# EAGLE design ETH_EX_M32 (EAGLE 4.16)
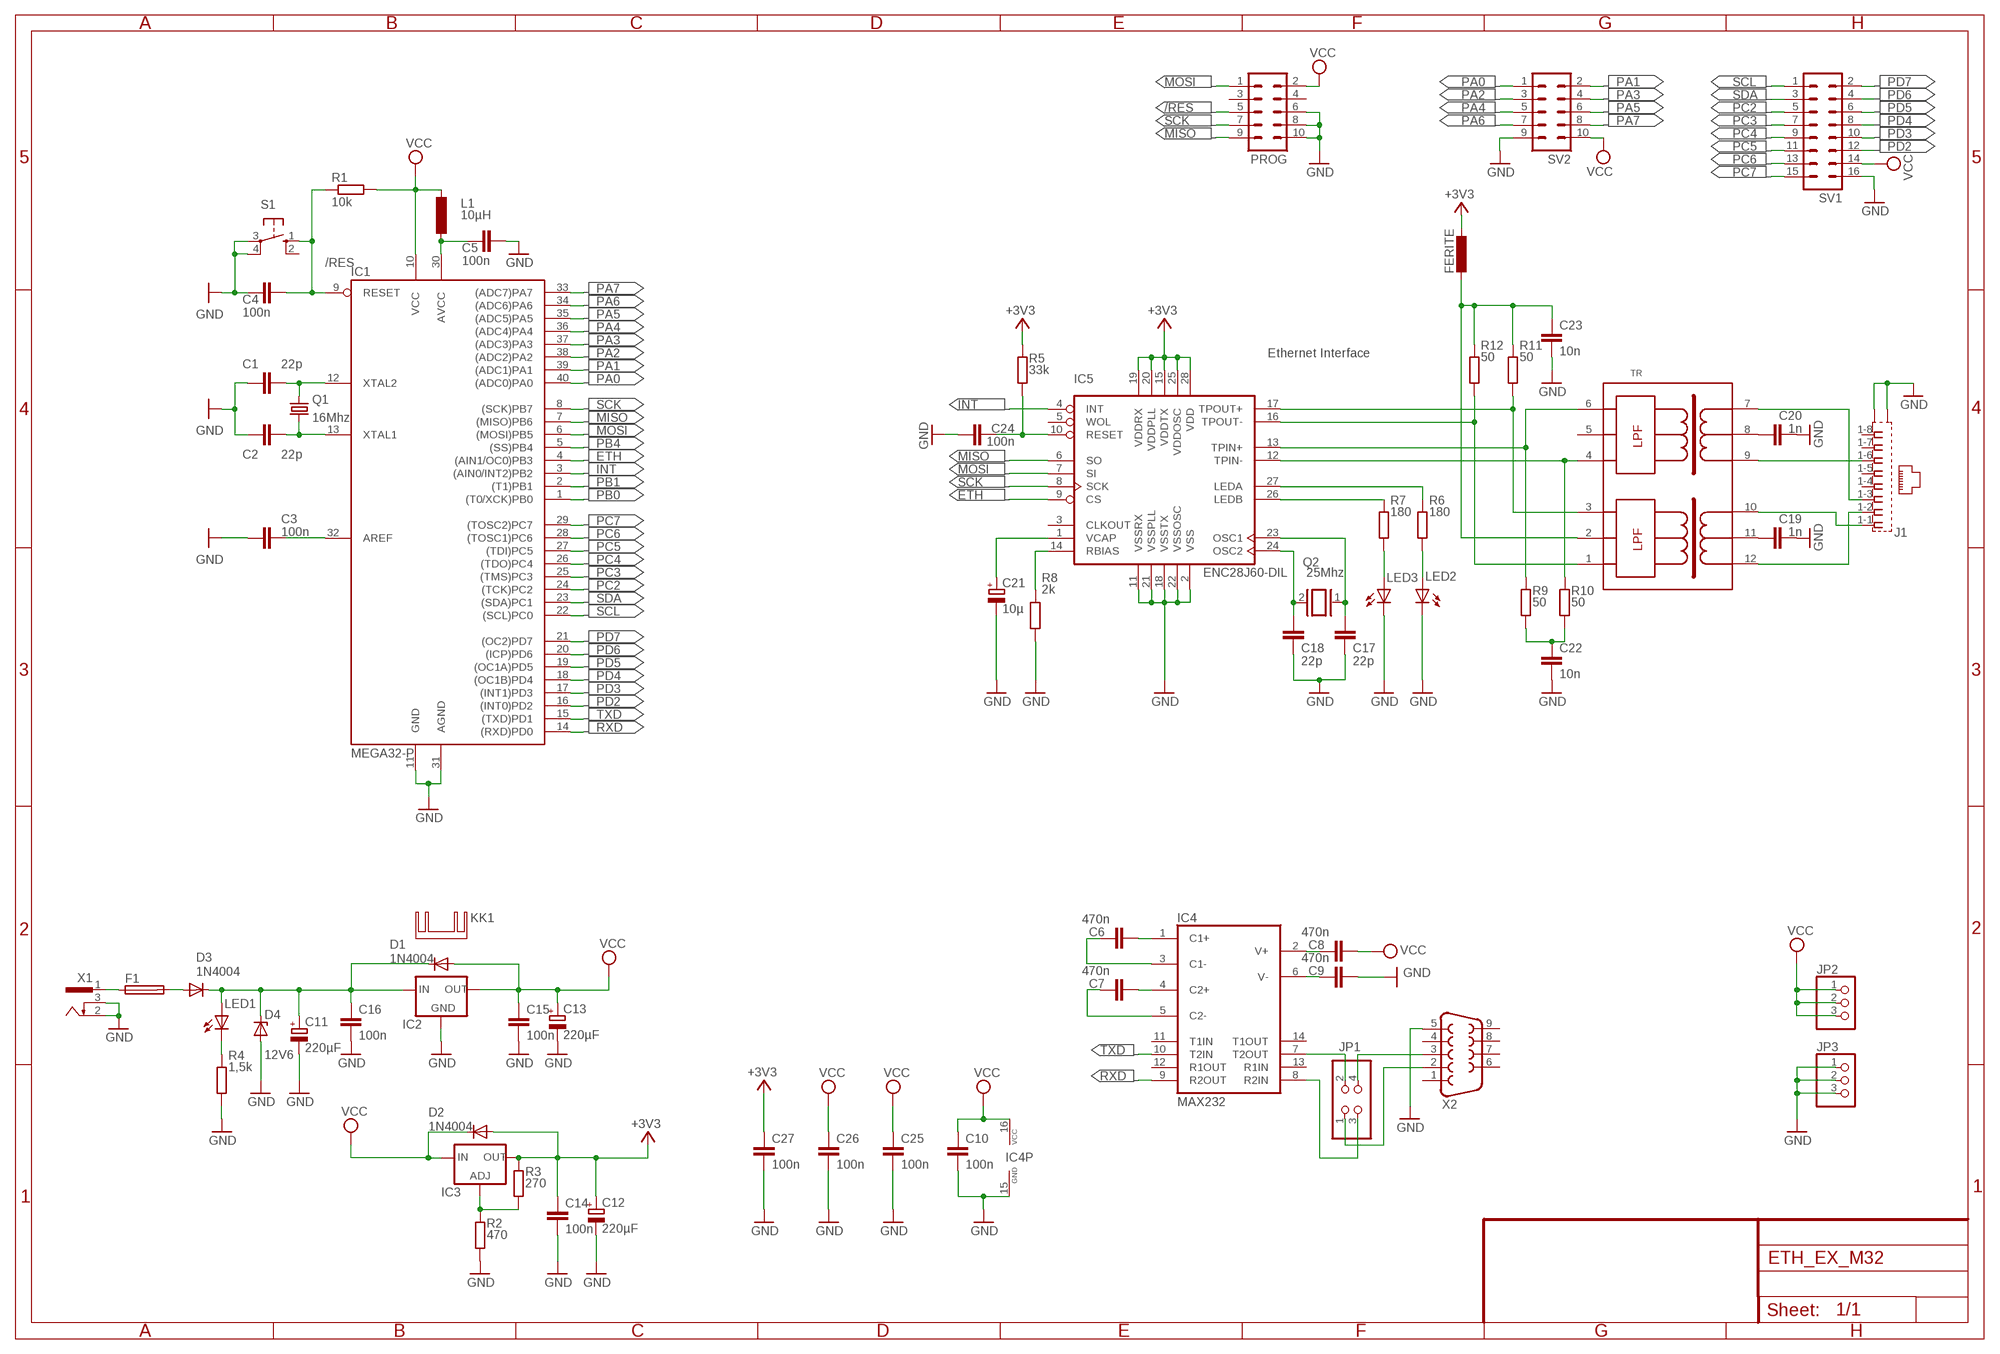
[diagram p0: schematic, sheet 1]

## Parts
C1  22p  C-EU025-024X044  [C025-024X044]
C2  22p  C-EU025-024X044  [C025-024X044]
C3  100n  C-EU025-025X050  [C025-025X050]
C4  100n  C-EU025-024X044  [C025-024X044]
C5  100n  C-EU025-024X044  [C025-024X044]
C6  470n  C-EU050-024X044  [C050-024X044]
C7  470n  C-EU050-024X044  [C050-024X044]
C8  470n  C-EU050-024X044  [C050-024X044]
C9  470n  C-EU050-024X044  [C050-024X044]
C10  100n  C-EU050-024X044  [C050-024X044]
C11  220µF  CPOL-EUE3.5-8  [E3,5-8]
C12  220µF  CPOL-EUE3.5-8  [E3,5-8]
C13  220µF  CPOL-EUE3.5-8  [E3,5-8]
C14  100n  C-EU025-024X044  [C025-024X044]
C15  100n  C-EU050-024X044  [C050-024X044]
C16  100n  C-EU050-024X044  [C050-024X044]
C17  22p  C-EU025-024X044  [C025-024X044]
C18  22p  C-EU025-024X044  [C025-024X044]
C19  1n  C-EU025-024X044  [C025-024X044]
C20  1n  C-EU025-024X044  [C025-024X044]
C21  10µ  CPOL-EUE2-5  [E2-5]
C22  10n  C-EU025-025X050  [C025-025X050]
C23  10n  C-EU025-025X050  [C025-025X050]
C24  100n  C-EU025-024X044  [C025-024X044]
C25  100n  C-EU025-025X050  [C025-025X050]
C26  100n  C-EU025-025X050  [C025-025X050]
C27  100n  C-EU025-025X050  [C025-025X050]
D1  1N4004  [DO41-10]
D2  1N4004  [DO41-10]
D3  1N4004  [DO41-10]
D4  12V6  BZX90  [DO34Z7]
F1  PICOFUSE  [PICOFUSE]
FERITE  L-EU0204/5  [0204/5]
IC1  MEGA32-P  [DIL40]
IC2  78XXS  [78XXS]
IC3  LM317TS  [317TS]
IC4  MAX232  [DIL16]
IC5  ENC28J60-DIL  [DIL28-3]
J1  557786-1  [557786-1]
JP1  PINHD-2X2  [2X02]
JP2  PINHD-1X3  [1X03]
JP3  PINHD-1X3  [1X03]
KK1  SK95-2M3  [SK95-2M3]
L1  10µH  L-EU0207/10  [0207/10]
LED1  LED3MM  [LED3MM]
LED2  LED3MM  [LED3MM]
LED3  LED3MM  [LED3MM]
PROG  ML10  [ML10]
Q1  16Mhz  CRYTALHC49U-V  [HC49U-V]
Q2  25Mhz  XTAL/S  [QS]
R1  10k  R-EU_0207/10  [0207/10]
R2  470  R-EU_0207/10  [0207/10]
R3  270  R-EU_0207/10  [0207/10]
R4  1,5k  R-EU_0207/10  [0207/10]
R5  33k  R-EU_0207/10  [0207/10]
R6  180  R-EU_0207/10  [0207/10]
R7  180  R-EU_0207/10  [0207/10]
R8  2k  R-EU_0207/10  [0207/10]
R9  50  R-EU_0207/10  [0207/10]
R10  50  R-EU_0207/10  [0207/10]
R11  50  R-EU_0207/10  [0207/10]
R12  50  R-EU_0207/10  [0207/10]
S1  10-XX  [B3F-10XX]
SV1  ML16  [ML16]
SV2  ML10  [ML10]
TR  20F001  [DIL16/12]
X1  SCD-014A  [SCD-014-A]
X2  F09HP  [F09HP]

## Nets
+3V3: C12.+ C14.1 C27.1 D2.A FERITE.1 IC3.2(OUT) IC5.15(VDDTX) IC5.19(VDDRX) IC5.20(VDDPLL) IC5.25(VDDOSC) IC5.28(VDD) R3.2 R5.2
/RES: C4.2 IC1.9(RESET) PROG.5 R1.1 S1.1(S)
ETH: IC1.4((AIN1/OC0)PB3) IC5.9(CS)
GND: C1.1 C2.1 C3.1 C4.1 C5.2 C9.2 C10.2 C11.- C12.- C13.- C14.2 C15.2 C16.2 C17.1 C18.1 C19.2 C20.2 C21.- C22.2 C23.2 C24.1 C25.1 C26.2 C27.2 D4.A IC1.11(GND) IC1.31(AGND) IC2.GND IC4.15(GND) IC5.2(VSS) IC5.11(VSSRX) IC5.18(VSSTX) IC5.21(VSSPLL) IC5.22(VSSOSC) J1.G1(S2) J1.G2(S1) JP3.1 JP3.2 JP3.3 LED2.K(C) LED3.K(C) PROG.6 PROG.8 PROG.10 R2.1 R4.1 R8.1 S1.3(P) S1.4(P1) SV1.16 SV2.9 X1.2 X1.3 X2.5
INT: IC1.3((AIN0/INT2)PB2) IC5.4(INT)
MISO: IC1.7((MISO)PB6) IC5.6(SO) PROG.9
MOSI: IC1.6((MOSI)PB5) IC5.7(SI) PROG.1
N$1: C2.2 IC1.13(XTAL1) Q1.1
N$2: C1.2 IC1.12(XTAL2) Q1.2
N$3: C3.2 IC1.32(AREF)
N$4: LED1.K(C) R4.2
N$5: C5.1 IC1.30(AVCC) L1.2
N$6: D3.A F1.2
N$7: J1.1-2 TR.12
N$8: J1.1-1 TR.10
N$10: F1.1 X1.1
N$11: IC5.27(LEDA) R6.2
N$12: IC3.1(ADJ) R2.2 R3.1
N$13: J1.1-6 TR.9
N$14: IC5.26(LEDB) R7.2
N$15: J1.1-3 TR.7
N$16: C20.1 TR.8
N$17: C19.1 TR.11
N$18: LED3.A R7.1
N$19: LED2.A R6.1
N$20: C18.2 IC5.24(OSC2) Q2.2
N$21: C17.2 IC5.23(OSC1) Q2.1
N$22: IC5.12(TPIN-) R10.2 TR.4
N$23: IC5.13(TPIN+) R9.2 TR.6
N$24: IC5.16(TPOUT-) R12.2 TR.1
N$25: IC5.17(TPOUT+) R11.2 TR.3
N$26: IC5.14(RBIAS) R8.2
N$27: C21.+ IC5.1(VCAP)
N$29: C22.1 R9.1 R10.1
N$30: C24.2 IC5.10(RESET) R5.1
N$40: JP1.1 X2.2
N$49: JP1.4 X2.3
N$50: IC4.8(R2IN) JP1.3
N$51: IC4.7(T2OUT) JP1.2
N$52: C7.2 IC4.4(C2+)
N$53: C7.1 IC4.5(C2-)
N$56: C6.1 IC4.3(C1-)
N$57: C6.2 IC4.1(C1+)
N$58: C8.1 IC4.2(V+)
N$59: C9.1 IC4.6(V-)
N$248: C23.1 FERITE.2 R11.1 R12.1 TR.2
N$250: C11.+ C16.1 D1.C D3.C D4.C IC2.IN LED1.A
PA0: IC1.40((ADC0)PA0) SV2.1
PA1: IC1.39((ADC1)PA1) SV2.2
PA2: IC1.38((ADC2)PA2) SV2.3
PA3: IC1.37((ADC3)PA3) SV2.4
PA4: IC1.36((ADC4)PA4) SV2.5
PA5: IC1.35((ADC5)PA5) SV2.6
PA6: IC1.34((ADC6)PA6) SV2.7
PA7: IC1.33((ADC7)PA7) SV2.8
PB0: IC1.1((T0/XCK)PB0)
PB1: IC1.2((T1)PB1)
PB4: IC1.5((SS)PB4)
PC2: IC1.24((TCK)PC2) SV1.5
PC3: IC1.25((TMS)PC3) SV1.7
PC4: IC1.26((TDO)PC4) SV1.9
PC5: IC1.27((TDI)PC5) SV1.11
PC6: IC1.28((TOSC1)PC6) SV1.13
PC7: IC1.29((TOSC2)PC7) SV1.15
PD2: IC1.16((INT0)PD2) SV1.12
PD3: IC1.17((INT1)PD3) SV1.10
PD4: IC1.18((OC1B)PD4) SV1.8
PD5: IC1.19((OC1A)PD5) SV1.6
PD6: IC1.20((ICP)PD6) SV1.4
PD7: IC1.21((OC2)PD7) SV1.2
RXD: IC1.14((RXD)PD0) IC4.9(R2OUT)
SCK: IC1.8((SCK)PB7) IC5.8(SCK) PROG.7
SCL: IC1.22((SCL)PC0) SV1.1
SDA: IC1.23((SDA)PC1) SV1.3
TXD: IC1.15((TXD)PD1) IC4.10(T2IN)
VCC: C8.2 C10.1 C13.+ C15.1 C25.2 C26.1 D1.A D2.C IC1.10(VCC) IC2.OUT IC3.3(IN) IC4.16(VCC) JP2.1 JP2.2 JP2.3 L1.1 PROG.2 R1.2 SV1.14 SV2.10
Unconnected: IC4.11(T1IN) IC4.12(R1OUT) IC4.13(R1IN) IC4.14(T1OUT) IC5.3(CLKOUT) IC5.5(WOL) J1.1-4 J1.1-5 J1.1-7 J1.1-8 PROG.3 PROG.4 S1.2(S1) TR.5 X2.1 X2.4 X2.6 X2.7 X2.8 X2.9

## Notes on the sheet
- Ethernet Interface

## Library data of the parts
C1-C10 C14-C20 C22-C27 = rcl:C-EU: CAPACITOR, European symbol
C11-C13 C21 = rcl:CPOL-EU: POLARIZED CAPACITOR, European symbol
D1-D3 = diode:1N4004: DIODE general purpose rectifier, 1 A
D4 = diode:BZX90: Z DIODE
F1 = fuse:PICOFUSE: PICOFUSE 19275, Wickmann
FERITE L1 = rcl:L-EU: INDUCTOR, European symbol
IC1 = avr-1:MEGA32-P: MICROCONTROLLER 32 Kbytes FLASH 2 Kbytes SRAM 1 Kbytes EEPROM USART 8-channel 10 bit ADC
IC2 = v-reg:78XXS: VOLTAGE REGULATOR
IC3 = v-reg:LM317TS: VOLTAGE REGULATOR
IC4 = maxim:MAX232: RS232 TRANSEIVER
IC5 = enc28j60centered:ENC28J60-*: Microchip 10Mbit Ethernet controller with SPI interface Improved SOIC28 layout (pads in 0.01 raster, pin1 slightly smaller). Pin 6 (SO) changed from Out (paralleling several Outs gives an error) to OC. Author: Profi from mikrocontroller.net - forum Date: 2006.0827
J1 = con-amp:557786-1: AMP connector
JP1 = pinhead:PINHD-2X2: PIN HEADER
JP2 JP3 = pinhead:PINHD-1X3: PIN HEADER
KK1 = heatsink:SK95-2M3: HEATSINK manufacturer Fischer/distributor Buerklin
LED1-LED3 = led:LED: LED OSRAM: - CHIPLED LG R971, LG N971, LY N971, LG Q971, LY Q971, LO R971, LY R971 LH N974, LH R974 LS Q976, LO Q976, LY Q976 LO Q996 - Hyper CHIPLED LW Q18S LB Q993, LB Q99A, LB R99A - SideLED LS A670, LO A670, LY A670, LG A670, LP A670 LB A673, LV A673, LT A673, LW A673 LH A674 LY A675 LS A676, LA A676, LO A676, LY A676, LW A676 LS A679, LY A679, LG A679 - Hyper Micro SIDELED® LS Y876, LA Y876, LO Y876, LY Y876 LT Y87S - SmartLED LW L88C, LW L88S LB L89C, LB L89S, LG L890 LS L89K, LO L89K, LY L89K LS L896, LA L896, LO L896, LY L896 - TOPLED LS T670, LO T670, LY T670, LG T670, LP T670 LSG T670, LSP T670, LSY T670, LOP T670, LYG T670 LG T671, LOG T671, LSG T671 LB T673, LV T673, LT T673, LW T673 LH T674 LS T676, LA T676, LO T676, LY T676, LB T676, LH T676, LSB T676, LW T676 LB T67C, LV T67C, LT T67C, LS T67K, LO T67K, LY T67K, LW E67C LS E67B, LA E67B, LO E67B, LY E67B, LB E67C, LV E67C, LT E67C LW T67C LS T679, LY T679, LG T679 LS T770, LO T770, LY T770, LG T770, LP T770 LB T773, LV T773, LT T773, LW T773 LH T774 LS E675, LA E675, LY E675, LS T675 LS T776, LA T776, LO T776, LY T776, LB T776 LHGB T686 LT T68C, LB T68C - Hyper Mini TOPLED® LB M676 - Mini TOPLED Santana® LG M470 LS M47K, LO M47K, LY M47K Source: http://www.osram.convergy.de/
PROG SV2 = con-harting-ml:ML10: HARTING
Q1 = crystal:CRYTAL: CRYSTAL
Q2 = special:XTAL/S: CRYSTAL
R1-R12 = rcl:R-EU_: RESISTOR, European symbol
S1 = switch-omron:10-XX: OMRON SWITCH
SV1 = con-harting-ml:ML16: HARTING
TR = Realtek:20F001
X1 = con-shiua-chyuan:SCD-014A: Power Jack 2.5mm
X2 = con-subd:F09: SUB-D

## Board
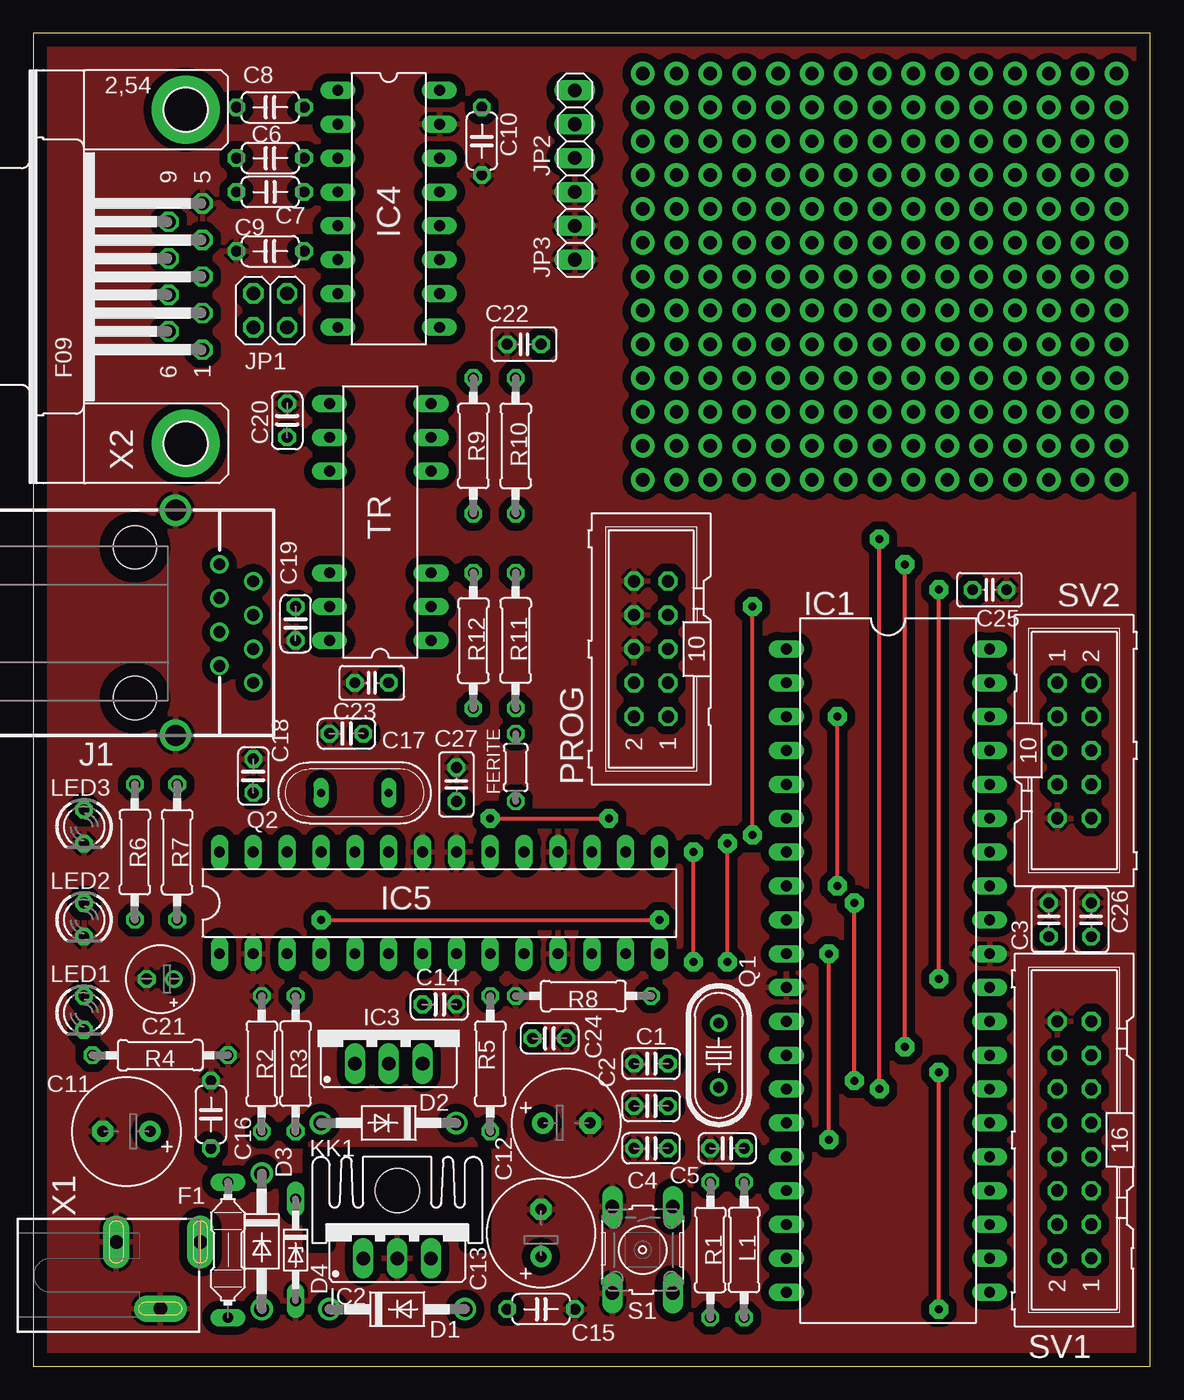
[diagram p1: board, top side]
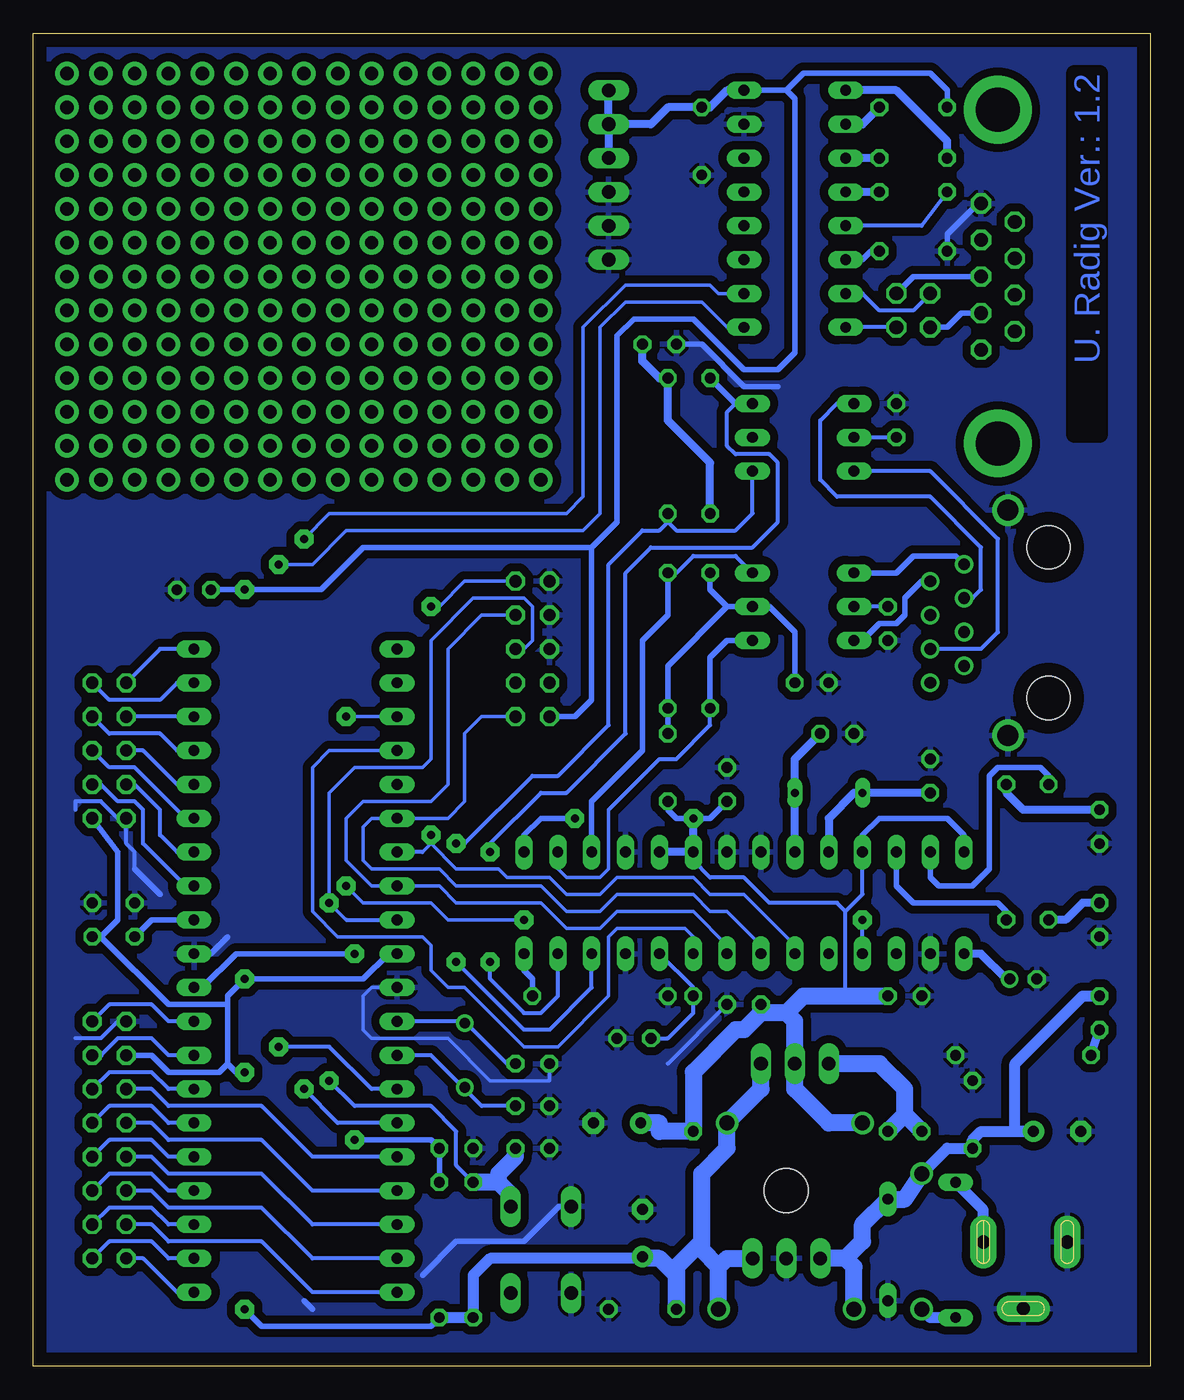
[diagram p2: board, bottom side, seen from below]

Size 83.8 x 100 mm. Coordinates in mm from the lower left corner, seen from the top.
Outline: 0,0 83.8,0 83.8,100 0,100 0,0
Copper layers (1*16): Top 0.035mm / dielectric 1.5mm / Bottom 0.035mm
Design rules "default": minimum track width 10mil, minimum drill 24mil, track to track 8mil, track to pad 8mil, pad to pad 8mil, via to via 8mil, smd to smd 8mil, copper to edge 40mil, drill to drill 8mil, minimum pad ring 10mil, minimum via ring 8mil, stop-mask expansion 4mil, vias tented up to drill 0mil, thermal gap 10mil

### Footprints (pad centres in the part's own frame; a part is rotated, then mirrored left to right if it is on the bottom)
C025-024X044 = drill 0.813 octagon: 1 -1.27,0; 2 1.27,0
C025-025X050 = drill 0.813 octagon: 1 -1.27,0; 2 1.27,0
C050-024X044 = drill 0.813 octagon: 1 -2.54,0; 2 2.54,0
E3,5-8 = drill 0.813 pad 1.6 round: + -1.778,0 | drill 0.813 pad 1.6 octagon: - 1.778,0
E2-5 = drill 0.813 pad 1.27 round: + -1.016,0 | drill 0.813 pad 1.27 octagon: - 1.016,0
DO41-10 = drill 1.118 round: A 5.08,0; C -5.08,0
DO34Z7 = drill 0.813 long: A 3.81,0; C -3.81,0
PICOFUSE = drill 0.813 long: 1 -5.08,0; 2 5.08,0
0204/5 = drill 0.813 octagon: 1 -2.54,0; 2 2.54,0
DIL40 = drill 0.813 long: 1 -24.13,-7.62; 2 -21.59,-7.62; 3 -19.05,-7.62; 4 -16.51,-7.62; 5 -13.97,-7.62; 6 -11.43,-7.62; 7 -8.89,-7.62; 8 -6.35,-7.62; 9 -3.81,-7.62; 10 -1.27,-7.62; 11 1.27,-7.62; 12 3.81,-7.62; 13 6.35,-7.62; 14 8.89,-7.62; 15 11.43,-7.62; 16 13.97,-7.62; 17 16.51,-7.62; 18 19.05,-7.62; 19 21.59,-7.62; 20 24.13,-7.62; 21 24.13,7.62; 22 21.59,7.62; 23 19.05,7.62; 24 16.51,7.62; 25 13.97,7.62; 26 11.43,7.62; 27 8.89,7.62; 28 6.35,7.62; 29 3.81,7.62; 30 1.27,7.62; 31 -1.27,7.62; 32 -3.81,7.62; 33 -6.35,7.62; 34 -8.89,7.62; 35 -11.43,7.62; 36 -13.97,7.62; 37 -16.51,7.62; 38 -19.05,7.62; 39 -21.59,7.62; 40 -24.13,7.62
78XXS = drill 1.016 long: GND 0,-2.54; IN -2.54,-2.54; OUT 2.54,-2.54
317TS = drill 1.016 long: 1 -2.54,-2.54; 2 0,-2.54; 3 2.54,-2.54
DIL16 = drill 0.813 long: 1 -8.89,-3.81; 2 -6.35,-3.81; 3 -3.81,-3.81; 4 -1.27,-3.81; 5 1.27,-3.81; 6 3.81,-3.81; 7 6.35,-3.81; 8 8.89,-3.81; 9 8.89,3.81; 10 6.35,3.81; 11 3.81,3.81; 12 1.27,3.81; 13 -1.27,3.81; 14 -3.81,3.81; 15 -6.35,3.81; 16 -8.89,3.81
DIL28-3 = drill 0.813 long: 1 -16.51,-3.81; 2 -13.97,-3.81; 3 -11.43,-3.81; 4 -8.89,-3.81; 5 -6.35,-3.81; 6 -3.81,-3.81; 7 -1.27,-3.81; 8 1.27,-3.81; 9 3.81,-3.81; 10 6.35,-3.81; 11 8.89,-3.81; 12 11.43,-3.81; 13 13.97,-3.81; 14 16.51,-3.81; 15 16.51,3.81; 16 13.97,3.81; 17 11.43,3.81; 18 8.89,3.81; 19 6.35,3.81; 20 3.81,3.81; 21 1.27,3.81; 22 -1.27,3.81; 23 -3.81,3.81; 24 -6.35,3.81; 25 -8.89,3.81; 26 -11.43,3.81; 27 -13.97,3.81; 28 -16.51,3.81
557786-1 = drill 0.889 round: 1-1 -4.445,6.35; 1-2 -3.175,8.89; 1-3 -1.905,6.35; 1-4 -0.635,8.89; 1-5 0.635,6.35; 1-6 1.905,8.89; 1-7 3.175,6.35; 1-8 4.445,8.89 | drill 1.575 pad 2.184 round: G1 -8.509,3.048; G2 8.382,3.048 | hole 3.251: -5.715,0; 5.588,0
2X02 = drill 1.016 octagon: 1 -1.27,-1.27; 2 -1.27,1.27; 3 1.27,-1.27; 4 1.27,1.27
1X03 = drill 1.016 long: 1 -2.54,0; 2 0,0; 3 2.54,0
SK95-2M3 = hole 3.302: 0,2.54
0207/10 = drill 0.813 octagon: 1 -5.08,0; 2 5.08,0
LED3MM = drill 0.813 octagon: A -1.27,0; K 1.27,0
ML10 = drill 0.914 octagon: 1 -5.08,-1.27; 2 -5.08,1.27; 3 -2.54,-1.27; 4 -2.54,1.27; 5 0,-1.27; 6 0,1.27; 7 2.54,-1.27; 8 2.54,1.27; 9 5.08,-1.27; 10 5.08,1.27
HC49U-V = drill 0.813 round: 1 -2.413,0; 2 2.413,0
QS = drill 0.61 long: 1 -2.54,0; 2 2.54,0
B3F-10XX = drill 1.016 long: 1 -3.251,2.261; 2 3.251,2.261; 3 -3.251,-2.261; 4 3.251,-2.261
ML16 = drill 0.914 octagon: 1 -8.89,-1.27; 2 -8.89,1.27; 3 -6.35,-1.27; 4 -6.35,1.27; 5 -3.81,-1.27; 6 -3.81,1.27; 7 -1.27,-1.27; 8 -1.27,1.27; 9 1.27,-1.27; 10 1.27,1.27; 11 3.81,-1.27; 12 3.81,1.27; 13 6.35,-1.27; 14 6.35,1.27; 15 8.89,-1.27; 16 8.89,1.27
DIL16/12 = drill 0.813 long: 1 -8.89,-3.81; 2 -6.35,-3.81; 3 -3.81,-3.81; 4 3.81,-3.81; 5 6.35,-3.81; 6 8.89,-3.81; 7 8.89,3.81; 8 6.35,3.81; 9 3.81,3.81; 10 -3.81,3.81; 11 -6.35,3.81; 12 -8.89,3.81
SCD-014-A = drill 1 pad 2 long: 1 -2.5,13.8; 2 -2.5,7.5; 3 2.5,10.8
F09HP = drill 1.016 octagon: 1 -5.486,-1.27; 2 -2.743,-1.27; 3 0,-1.27; 4 2.743,-1.27; 5 5.486,-1.27; 6 -4.115,1.27; 7 -1.372,1.27; 8 1.372,1.27; 9 4.115,1.27 | drill 3.302 pad 5.08 round: G1 -12.522,0; G2 12.522,0

### Placement (x,y rotation side)
C1  46.35,22.7 0 top
C2  46.35,19.52 0 top
C3  76.2,33.49 270 top
C4  46.35,16.35 0 top
C5  52.06,16.35 180 top
C6  17.78,90.64 180 top
C7  17.78,88.1 0 top
C8  17.78,94.45 180 top
C9  17.78,83.65 180 top
C10  33.65,91.91 270 top
C11  6.98,17.62 180 top
C12  40,18.25 0 top
C13  38.09,10 90 top
C14  30.48,27.14 0 top
C15  38.09,4.28 0 top
C16  13.33,18.89 90 top
C17  23.49,47.46 0 top
C18  16.51,44.29 270 top
C19  19.68,55.72 270 top
C20  19.05,70.95 90 top
C21  9.52,29.05 180 top
C22  36.82,76.67 180 top
C23  25.39,51.27 180 top
C24  38.73,24.6 180 top
C25  71.75,58.26 180 top
C26  79.37,33.49 90 top
C27  31.75,43.65 90 top
D1  27.3,4.28 0 top
D2  26.67,18.25 180 top
D3  17.14,9.36 270 top
D4  19.68,8.73 270 top
F1  14.6,8.73 270 top
FERITE  36.19,44.92 90 top
IC1  64.13,29.68 270 top
IC2  27.3,10.63 0 top
IC3  26.67,25.23 0 top
IC4  26.67,86.83 270 top
IC5  30.48,34.76 0 top
J1  7.62,55.72 270 top
JP1  17.78,79.21 0 top
JP2  40.63,93.18 90 top
JP3  40.63,85.56 90 top
KK1  27.3,10.63 0 top
L1  53.34,8.73 90 top
LED1  3.81,26.51 270 top
LED2  3.81,33.49 270 top
LED3  3.81,40.48 270 top
PROG  46.35,53.81 90 top
Q1  51.43,23.33 90 top
Q2  24.12,43.02 180 top
R1  50.79,8.73 270 top
R2  17.14,22.7 270 top
R3  19.68,22.7 90 top
R4  9.52,23.33 180 top
R5  34.28,22.7 270 top
R6  7.62,38.57 90 top
R7  10.79,38.57 270 top
R8  41.27,27.78 0 top
R9  33.02,69.05 90 top
R10  36.19,69.05 270 top
R11  36.19,54.45 90 top
R12  33.02,54.45 270 top
S1  45.71,8.73 270 top
SV1  78.1,16.98 90 top
SV2  78.1,46.19 270 top
TR  26.03,63.34 90 top
X1  -1.27,6.82 270 top
X2  11.42,81.75 90 top

### Tracks (layer width: path | path; a pad name or v marks a point on that pad's centre or on a via)
+3V3  (via drill 0.6 pad 1.42)
  Top 0.305: v34.28,41.11 v43.17,41.11
  Bottom 0.305: IC5.25 21.59,35.4 22.86,34.12 | IC5.20 34.28,37.94 33.02,36.66 30.48,36.66 28.57,34.76 23.49,34.76 22.86,34.12 | 22.86,27.78 22.86,34.12
  Bottom 0.406: IC5.28 13.96,39.84 15.23,41.11 20.32,41.11 21.59,39.84 IC5.25 | v43.17,41.11 45.71,41.11 46.98,39.84 IC5.15 | C27.1 33.02,41.11 v34.28,41.11 | v34.28,41.11 34.92,41.11 | v34.28,41.11 35.55,41.11 36.19,41.74 FERITE.1 | IC5.20 IC5.19 IC5.20
  Bottom 0.61: IC5.19 IC5.20 v34.28,41.11
  Bottom 1.27: C12.+ 36.82,18.25 36.82,17.62 R5.2 34.28,22.06 31.11,25.23 30.48,25.23 29.21,26.51 | D2.A 24.12,18.25 26.67,20.79 IC3.2 26.67,25.87 27.3,26.51 | 29.21,26.51 C14.1 | 27.3,26.51 29.21,26.51 | R3.2 22.86,27.78 26.03,27.78 27.3,26.51
/RES  (via drill 0.6 pad 1.42)
  Top 0.305: v61.59,21.43 v61.59,34.76
  Bottom 0.254: 60.32,33.49 v61.59,34.76 61.59,43.02 59.68,44.92 54.6,44.92 53.97,45.55 53.97,54.45 50.79,57.62 46.98,57.62 46.35,56.98 46.35,54.45 46.98,53.81 PROG.5
  Bottom 0.305: 48.89,14.44 R1.1 52.06,15.08 52.06,17.62 53.97,19.52 59.68,19.52 v61.59,21.43 | 60.32,33.49 IC1.9
  Bottom 1.27: S1.1 47.98,12.89 48.89,13.81 | 48.89,13.81 R1.1 | 48.89,13.81 48.89,14.44 47.62,15.71 C4.2
ETH
  Bottom 0.254: IC5.9 34.28,32.22 34.92,32.86 40,32.86 40.63,32.22 40.63,27.78 44.45,23.96 46.98,23.96 51.43,28.41 52.7,28.41 53.97,29.68 53.97,31.59 54.6,32.22 60.95,32.22 62.86,34.12 62.86,44.92 61.59,46.19 IC1.4
GND
  Bottom 0.254: C1.1 45.08,21.43 49.52,21.43 52.7,24.6 58.41,24.6 59.05,25.23 59.05,27.78 58.41,28.41 IC1.11
  Bottom 0.305: SV1.16 77.47,25.87 78.73,24.6 80.64,24.6 | 76.2,37.3 76.2,38.57 76.83,39.2 SV2.9 77.47,41.11 78.73,42.38 80.64,42.38 80.64,41.74 | C14.2 36.19,22.7
  Bottom 0.406: 74.29,35.4 76.2,37.3 | C22.2 33.65,76.67 30.48,73.49 27.94,73.49 | X2.5 12.92,87.24 15.23,84.92 C9.2 | IC1.31 70.48,30.95 69.21,32.22 | S1.3 44.37,11.98 46.98,9.36 52.06,9.36 54.6,6.82 | 62.86,4.28 63.49,4.92
  pour Bottom (isolate 0.61): 0.63,99.53 0.63,0.47 83.18,0.47 83.18,99.53
  pour Top (isolate 0.61): 0.63,99.53 83.18,99.53 83.18,0.47 0.63,0.47
INT  (via drill 0.6 pad 1.42)
  Top 0.305: v21.59,33.49 v46.98,33.49 | v60.32,36.03 v60.32,48.73
  Bottom 0.254: v46.98,33.49 52.7,33.49 53.97,34.76 59.05,34.76 v60.32,36.03 | v60.32,48.73 IC1.3
  Bottom 0.305: IC5.4 v21.59,33.49
MISO  (via drill 0.6 pad 1.42)
  Top 0.305: v53.97,39.84 v53.97,56.98
  Bottom 0.254: IC5.6 26.67,31.59 30.48,35.4 33.02,35.4 34.28,36.66 40,36.66 41.27,35.4 43.81,35.4 45.08,36.66 48.25,36.66 48.89,37.3 52.06,37.3 53.97,39.2 | v53.97,56.98 53.34,56.98 51.43,58.89 PROG.9 | 53.97,39.2 v53.97,39.84 | 53.97,39.2 54.6,38.57
  Bottom 0.305: 54.6,38.57 IC1.7
MOSI
  Bottom 0.254: IC5.7 29.21,31.59 31.75,34.12 33.02,34.12 34.28,35.4 40,35.4 41.27,34.12 43.81,34.12 45.71,36.03 52.06,36.03 53.34,37.3 58.41,37.3 59.05,37.94 59.05,40.48 58.41,41.11 IC1.6 52.7,41.11 51.43,42.38 51.43,47.46 50.16,48.73 PROG.1
N$1
  Bottom 0.305: C2.2 50.16,19.52 51.43,20.79 | 51.43,20.79 Q1.1 | 51.43,20.79 53.97,23.33 IC1.13
N$2
  Bottom 0.305: C1.2 48.25,22.7 51.43,25.87 | 51.43,25.87 Q1.2 | 51.43,25.87 IC1.12
N$3
  Bottom 0.406: C3.2 74.93,33.49 IC1.32
N$4
  Bottom 0.61: R4.2 LED1.K
N$5  (via drill 0.6 pad 1.42)
  Top 0.305: v59.68,16.98 v59.68,30.95
  Bottom 0.305: 71.12,28.41 IC1.30
  Bottom 0.406: L1.2 C5.1 53.97,16.98 v59.68,16.98 | v59.68,30.95 68.58,30.95 71.12,28.41
N$6
  Bottom 0.813: F1.2 16.51,3.65 D3.A
N$7
  Bottom 0.406: J1.1-2 17.14,58.89 18.41,57.62 18.41,56.35 19.05,55.72 20.32,55.72 21.59,54.45 TR.12
N$8
  Bottom 0.406: J1.1-1 14.6,60.8 17.78,60.8 19.05,59.52 TR.10
N$9  (via drill 1 pad 1.78)
  other vias: 45.71,79.21
N$10
  Bottom 0.813: X1.1 12.52,11.73 F1.1
N$11
  Bottom 0.406: IC5.27 16.51,36.66 15.87,36.03 13.33,36.03 12.06,37.3 12.06,44.29 11.42,44.92 8.25,44.92 7.62,44.29 R6.2
N$12
  Bottom 1.27: R2.2 18.41,18.89 | 18.41,18.89 R3.1 | 18.41,18.89 18.41,20.79 20.32,22.7 IC3.1
N$13
  Bottom 0.305: TR.9 16.51,67.14 11.42,62.06 11.42,55.08 12.69,53.81 J1.1-6
N$14
  Bottom 0.406: IC5.26 19.05,36.03 17.78,34.76 11.42,34.76 10.79,34.12 R7.2
N$15
  Bottom 0.305: TR.7 23.49,72.22 24.76,70.95 24.76,66.51 23.49,65.24 16.51,65.24 12.69,61.43 12.69,58.26 13.33,57.62 J1.1-3
N$16
  Bottom 0.305: C20.1 TR.8
N$17
  Bottom 0.305: C19.1 TR.11
N$18
  Bottom 0.406: 10.79,43.02 R7.1
  Bottom 0.61: LED3.A 9.52,41.74 10.79,43.02
N$19
  Bottom 0.61: LED2.A 5.08,34.76 6.34,33.49 R6.1
N$20
  Bottom 0.61: IC5.24 24.12,41.11 22.22,43.02 Q2.2 C18.2
N$21
  Bottom 0.61: IC5.23 Q2.1 26.67,45.55 C17.2
N$22  (via drill 0.6 pad 1.42)
  Top 0.305: v52.06,30.32 v52.06,39.2
  Bottom 0.305: TR.4 29.84,63.97 31.11,62.7 35.55,62.7 36.19,63.34 | 36.19,63.34 R10.2 | 36.19,63.34 36.82,62.7 38.09,62.7 40.63,60.16 40.63,48.09 44.45,44.29 46.35,44.29 51.43,39.2 v52.06,39.2 | IC5.12 41.9,28.41 45.08,25.23 46.98,25.23 v52.06,30.32
N$23  (via drill 0.6 pad 1.42)
  Top 0.305: v49.52,30.32 v49.52,38.57
  Bottom 0.305: 31.11,72.22 31.75,71.59 31.75,69.05 31.11,68.41 28.57,68.41 27.94,67.78 27.94,63.34 29.84,61.43 37.46,61.43 39.36,59.52 39.36,47.46 43.81,43.02 45.71,43.02 49.52,39.2 v49.52,38.57 | IC5.13 44.45,27.78 45.71,26.51 46.98,26.51 49.52,29.05 v49.52,30.32
  Bottom 0.406: TR.6 31.11,72.22 R9.2
N$24
  Bottom 0.254: IC5.16 44.45,37.3 43.81,36.66 41.27,36.66 40.63,37.3 40.63,41.74
  Bottom 0.305: 40.63,41.74 36.82,45.55 35.55,45.55 33.02,48.09 R12.2
  Bottom 0.406: TR.1 31.75,54.45 33.02,53.18 R12.2
N$25
  Bottom 0.305: TR.3 31.11,60.8 34.28,60.8 35.55,59.52 R11.2
  Bottom 0.406: IC5.17 41.9,42.38 38.09,46.19 38.09,54.45 36.19,56.35 R11.2
N$26
  Bottom 0.406: IC5.14 46.98,29.68 46.35,29.05 R8.2
N$27
  Bottom 0.61: C21.+ 10.79,29.05 12.69,30.95 IC5.1
N$28  (via drill 1 pad 1.78)
  other vias: 45.71,81.75
N$29
  Bottom 0.61: R9.1 33.02,67.78 36.19,70.95 R10.1 36.82,74.13 38.09,75.4 C22.1
N$30
  Bottom 0.305: IC5.10 34.28,28.41 R5.1 34.28,26.51 36.19,24.6 C24.2
N$31  (via drill 1 pad 1.78)
  other vias: 81.28,96.99
N$32  (via drill 1 pad 1.78)
  other vias: 78.73,96.99
N$33  (via drill 1 pad 1.78)
  other vias: 76.2,96.99
N$34  (via drill 1 pad 1.78)
  other vias: 73.66,96.99
N$35  (via drill 1 pad 1.78)
  other vias: 71.12,96.99
N$36  (via drill 1 pad 1.78)
  other vias: 68.58,96.99
N$37  (via drill 1 pad 1.78)
  other vias: 66.04,96.99
N$38  (via drill 1 pad 1.78)
  other vias: 63.49,96.99
N$39  (via drill 1 pad 1.78)
  other vias: 60.95,96.99
N$40
  Bottom 0.406: X2.2 14.17,79.01 15.23,77.94 JP1.1
N$41  (via drill 1 pad 1.78)
  other vias: 58.41,96.99
N$42  (via drill 1 pad 1.78)
  other vias: 55.88,96.99
N$43  (via drill 1 pad 1.78)
  other vias: 53.34,96.99
N$44  (via drill 1 pad 1.78)
  other vias: 53.34,94.45
N$45  (via drill 1 pad 1.78)
  other vias: 55.88,94.45
N$46  (via drill 1 pad 1.78)
  other vias: 58.41,94.45
N$47  (via drill 1 pad 1.78)
  other vias: 60.95,94.45
N$48  (via drill 1 pad 1.78)
  other vias: 63.49,94.45
N$49
  Bottom 0.406: X2.3 17.78,81.75 JP1.4
N$50
  Bottom 0.305: JP1.3 IC4.8
N$51
  Bottom 0.305: JP1.2 17.78,79.21 20.32,79.21 21.59,80.48 IC4.7
N$52
  Bottom 0.61: C7.2 IC4.4
N$53
  Bottom 0.305: C7.1 17.14,85.56 IC4.5
N$54  (via drill 1 pad 1.78)
  other vias: 66.04,94.45
N$55  (via drill 1 pad 1.78)
  other vias: 68.58,94.45
N$56
  Bottom 0.61: C6.1 IC4.3
N$57
  Bottom 0.61: C6.2 15.23,91.91 19.05,95.72 IC4.1
N$58
  Bottom 0.61: C8.1 21.59,93.18 IC4.2
N$59
  Bottom 0.406: C9.1 20.95,83.65 21.59,83.02 IC4.6
N$60  (via drill 1 pad 1.78)
  other vias: 71.12,94.45
N$61  (via drill 1 pad 1.78)
  other vias: 73.66,94.45
N$62  (via drill 1 pad 1.78)
  other vias: 76.2,94.45
N$63  (via drill 1 pad 1.78)
  other vias: 78.73,94.45
N$64  (via drill 1 pad 1.78)
  other vias: 81.28,94.45
N$66  (via drill 1 pad 1.78)
  other vias: 50.79,96.99
N$67  (via drill 1 pad 1.78)
  other vias: 50.79,94.45
N$68  (via drill 1 pad 1.78)
  other vias: 48.25,94.45
N$69  (via drill 1 pad 1.78)
  other vias: 48.25,96.99
N$70  (via drill 1 pad 1.78)
  other vias: 45.71,84.29
N$71  (via drill 1 pad 1.78)
  other vias: 45.71,86.83
N$72  (via drill 1 pad 1.78)
  other vias: 45.71,89.37
N$73  (via drill 1 pad 1.78)
  other vias: 48.25,91.91
N$74  (via drill 1 pad 1.78)
  other vias: 45.71,91.91
N$75  (via drill 1 pad 1.78)
  other vias: 48.25,89.37
N$76  (via drill 1 pad 1.78)
  other vias: 50.79,89.37
N$77  (via drill 1 pad 1.78)
  other vias: 50.79,91.91
N$78  (via drill 1 pad 1.78)
  other vias: 53.34,89.37
N$79  (via drill 1 pad 1.78)
  other vias: 53.34,91.91
N$80  (via drill 1 pad 1.78)
  other vias: 55.88,91.91
N$81  (via drill 1 pad 1.78)
  other vias: 55.88,89.37
N$82  (via drill 1 pad 1.78)
  other vias: 58.41,89.37
N$83  (via drill 1 pad 1.78)
  other vias: 58.41,91.91
N$84  (via drill 1 pad 1.78)
  other vias: 60.95,91.91
N$85  (via drill 1 pad 1.78)
  other vias: 60.95,89.37
N$86  (via drill 1 pad 1.78)
  other vias: 63.49,89.37
N$87  (via drill 1 pad 1.78)
  other vias: 63.49,91.91
N$88  (via drill 1 pad 1.78)
  other vias: 66.04,91.91
N$89  (via drill 1 pad 1.78)
  other vias: 66.04,89.37
N$90  (via drill 1 pad 1.78)
  other vias: 68.58,89.37
N$91  (via drill 1 pad 1.78)
  other vias: 68.58,91.91
N$92  (via drill 1 pad 1.78)
  other vias: 71.12,91.91
N$93  (via drill 1 pad 1.78)
  other vias: 71.12,89.37
N$94  (via drill 1 pad 1.78)
  other vias: 73.66,89.37
N$95  (via drill 1 pad 1.78)
  other vias: 73.66,91.91
N$96  (via drill 1 pad 1.78)
  other vias: 76.2,91.91
N$97  (via drill 1 pad 1.78)
  other vias: 76.2,89.37
N$98  (via drill 1 pad 1.78)
  other vias: 78.73,89.37
N$99  (via drill 1 pad 1.78)
  other vias: 78.73,91.91
N$100  (via drill 1 pad 1.78)
  other vias: 81.28,91.91
N$101  (via drill 1 pad 1.78)
  other vias: 81.28,89.37
N$104  (via drill 1 pad 1.78)
  other vias: 45.71,94.45
N$105  (via drill 1 pad 1.78)
  other vias: 45.71,96.99
N$108  (via drill 1 pad 1.78)
  other vias: 45.71,76.67
N$109  (via drill 1 pad 1.78)
  other vias: 45.71,74.13
N$110  (via drill 1 pad 1.78)
  other vias: 48.25,74.13
N$111  (via drill 1 pad 1.78)
  other vias: 48.25,76.67
N$112  (via drill 1 pad 1.78)
  other vias: 48.25,79.21
N$113  (via drill 1 pad 1.78)
  other vias: 48.25,81.75
N$114  (via drill 1 pad 1.78)
  other vias: 48.25,84.29
N$115  (via drill 1 pad 1.78)
  other vias: 48.25,86.83
N$116  (via drill 1 pad 1.78)
  other vias: 50.79,86.83
N$117  (via drill 1 pad 1.78)
  other vias: 50.79,84.29
N$118  (via drill 1 pad 1.78)
  other vias: 50.79,81.75
N$119  (via drill 1 pad 1.78)
  other vias: 50.79,79.21
N$120  (via drill 1 pad 1.78)
  other vias: 50.79,76.67
N$121  (via drill 1 pad 1.78)
  other vias: 50.79,74.13
N$122  (via drill 1 pad 1.78)
  other vias: 53.34,74.13
N$123  (via drill 1 pad 1.78)
  other vias: 53.34,76.67
N$124  (via drill 1 pad 1.78)
  other vias: 53.34,79.21
N$125  (via drill 1 pad 1.78)
  other vias: 53.34,81.75
N$126  (via drill 1 pad 1.78)
  other vias: 53.34,84.29
N$127  (via drill 1 pad 1.78)
  other vias: 53.34,86.83
N$128  (via drill 1 pad 1.78)
  other vias: 55.88,86.83
N$129  (via drill 1 pad 1.78)
  other vias: 55.88,84.29
N$130  (via drill 1 pad 1.78)
  other vias: 55.88,81.75
N$131  (via drill 1 pad 1.78)
  other vias: 55.88,79.21
N$132  (via drill 1 pad 1.78)
  other vias: 58.41,84.29
N$133  (via drill 1 pad 1.78)
  other vias: 58.41,86.83
N$134  (via drill 1 pad 1.78)
  other vias: 55.88,74.13
N$135  (via drill 1 pad 1.78)
  other vias: 55.88,76.67
N$136  (via drill 1 pad 1.78)
  other vias: 58.41,74.13
N$137  (via drill 1 pad 1.78)
  other vias: 58.41,76.67
N$138  (via drill 1 pad 1.78)
  other vias: 58.41,79.21
N$139  (via drill 1 pad 1.78)
  other vias: 58.41,81.75
N$140  (via drill 1 pad 1.78)
  other vias: 60.95,74.13
N$141  (via drill 1 pad 1.78)
  other vias: 60.95,76.67
N$142  (via drill 1 pad 1.78)
  other vias: 63.49,76.67
N$143  (via drill 1 pad 1.78)
  other vias: 63.49,74.13
N$144  (via drill 1 pad 1.78)
  other vias: 66.04,74.13
N$145  (via drill 1 pad 1.78)
  other vias: 66.04,76.67
N$146  (via drill 1 pad 1.78)
  other vias: 66.04,79.21
N$147  (via drill 1 pad 1.78)
  other vias: 66.04,81.75
N$148  (via drill 1 pad 1.78)
  other vias: 63.49,81.75
N$149  (via drill 1 pad 1.78)
  other vias: 63.49,79.21
N$150  (via drill 1 pad 1.78)
  other vias: 60.95,79.21
N$151  (via drill 1 pad 1.78)
  other vias: 60.95,81.75
N$152  (via drill 1 pad 1.78)
  other vias: 60.95,84.29
N$153  (via drill 1 pad 1.78)
  other vias: 60.95,86.83
N$154  (via drill 1 pad 1.78)
  other vias: 63.49,86.83
N$155  (via drill 1 pad 1.78)
  other vias: 63.49,84.29
N$156  (via drill 1 pad 1.78)
  other vias: 66.04,84.29
N$157  (via drill 1 pad 1.78)
  other vias: 66.04,86.83
N$158  (via drill 1 pad 1.78)
  other vias: 68.58,86.83
N$159  (via drill 1 pad 1.78)
  other vias: 68.58,84.29
N$160  (via drill 1 pad 1.78)
  other vias: 68.58,81.75
N$161  (via drill 1 pad 1.78)
  other vias: 68.58,79.21
N$162  (via drill 1 pad 1.78)
  other vias: 68.58,76.67
N$163  (via drill 1 pad 1.78)
  other vias: 68.58,74.13
N$164  (via drill 1 pad 1.78)
  other vias: 71.12,74.13
N$165  (via drill 1 pad 1.78)
  other vias: 71.12,76.67
N$166  (via drill 1 pad 1.78)
  other vias: 71.12,79.21
N$167  (via drill 1 pad 1.78)
  other vias: 71.12,81.75
N$168  (via drill 1 pad 1.78)
  other vias: 71.12,84.29
N$169  (via drill 1 pad 1.78)
  other vias: 71.12,86.83
N$170  (via drill 1 pad 1.78)
  other vias: 73.66,86.83
N$171  (via drill 1 pad 1.78)
  other vias: 73.66,84.29
N$172  (via drill 1 pad 1.78)
  other vias: 73.66,81.75
N$173  (via drill 1 pad 1.78)
  other vias: 73.66,79.21
N$174  (via drill 1 pad 1.78)
  other vias: 73.66,74.13
N$175  (via drill 1 pad 1.78)
  other vias: 73.66,76.67
N$176  (via drill 1 pad 1.78)
  other vias: 76.2,86.83
N$177  (via drill 1 pad 1.78)
  other vias: 78.73,86.83
N$178  (via drill 1 pad 1.78)
  other vias: 76.2,84.29
N$179  (via drill 1 pad 1.78)
  other vias: 76.2,81.75
N$180  (via drill 1 pad 1.78)
  other vias: 78.73,84.29
N$181  (via drill 1 pad 1.78)
  other vias: 81.28,86.83
N$182  (via drill 1 pad 1.78)
  other vias: 76.2,79.21
N$183  (via drill 1 pad 1.78)
  other vias: 78.73,81.75
N$184  (via drill 1 pad 1.78)
  other vias: 81.28,84.29
N$186  (via drill 1 pad 1.78)
  other vias: 76.2,76.67
N$187  (via drill 1 pad 1.78)
  other vias: 76.2,74.13
N$188  (via drill 1 pad 1.78)
  other vias: 78.73,74.13
N$189  (via drill 1 pad 1.78)
  other vias: 78.73,76.67
N$190  (via drill 1 pad 1.78)
  other vias: 78.73,79.21
N$191  (via drill 1 pad 1.78)
  other vias: 81.28,81.75
N$192  (via drill 1 pad 1.78)
  other vias: 81.28,79.21
N$193  (via drill 1 pad 1.78)
  other vias: 81.28,76.67
N$194  (via drill 1 pad 1.78)
  other vias: 81.28,74.13
N$200  (via drill 1 pad 1.78)
  other vias: 45.71,71.59
N$201  (via drill 1 pad 1.78)
  other vias: 48.25,71.59
N$202  (via drill 1 pad 1.78)
  other vias: 50.79,71.59
N$203  (via drill 1 pad 1.78)
  other vias: 53.34,71.59
N$204  (via drill 1 pad 1.78)
  other vias: 45.71,69.05
N$205  (via drill 1 pad 1.78)
  other vias: 48.25,69.05
N$206  (via drill 1 pad 1.78)
  other vias: 50.79,69.05
N$207  (via drill 1 pad 1.78)
  other vias: 53.34,69.05
N$208  (via drill 1 pad 1.78)
  other vias: 45.71,66.51
N$209  (via drill 1 pad 1.78)
  other vias: 48.25,66.51
N$210  (via drill 1 pad 1.78)
  other vias: 53.34,66.51
N$211  (via drill 1 pad 1.78)
  other vias: 50.79,66.51
N$212  (via drill 1 pad 1.78)
  other vias: 55.88,66.51
N$213  (via drill 1 pad 1.78)
  other vias: 55.88,69.05
N$214  (via drill 1 pad 1.78)
  other vias: 55.88,71.59
N$215  (via drill 1 pad 1.78)
  other vias: 58.41,71.59
N$216  (via drill 1 pad 1.78)
  other vias: 58.41,69.05
N$217  (via drill 1 pad 1.78)
  other vias: 58.41,66.51
N$218  (via drill 1 pad 1.78)
  other vias: 60.95,66.51
N$219  (via drill 1 pad 1.78)
  other vias: 60.95,69.05
N$220  (via drill 1 pad 1.78)
  other vias: 60.95,71.59
N$221  (via drill 1 pad 1.78)
  other vias: 63.49,71.59
N$222  (via drill 1 pad 1.78)
  other vias: 63.49,69.05
N$223  (via drill 1 pad 1.78)
  other vias: 63.49,66.51
N$224  (via drill 1 pad 1.78)
  other vias: 66.04,66.51
N$225  (via drill 1 pad 1.78)
  other vias: 66.04,69.05
N$226  (via drill 1 pad 1.78)
  other vias: 66.04,71.59
N$227  (via drill 1 pad 1.78)
  other vias: 68.58,71.59
N$228  (via drill 1 pad 1.78)
  other vias: 68.58,69.05
N$229  (via drill 1 pad 1.78)
  other vias: 68.58,66.51
N$230  (via drill 1 pad 1.78)
  other vias: 71.12,66.51
N$231  (via drill 1 pad 1.78)
  other vias: 71.12,69.05
N$232  (via drill 1 pad 1.78)
  other vias: 71.12,71.59
N$233  (via drill 1 pad 1.78)
  other vias: 73.66,71.59
N$234  (via drill 1 pad 1.78)
  other vias: 73.66,69.05
N$235  (via drill 1 pad 1.78)
  other vias: 73.66,66.51
N$236  (via drill 1 pad 1.78)
  other vias: 76.2,66.51
N$237  (via drill 1 pad 1.78)
  other vias: 76.2,69.05
N$238  (via drill 1 pad 1.78)
  other vias: 76.2,71.59
N$239  (via drill 1 pad 1.78)
  other vias: 78.73,71.59
N$240  (via drill 1 pad 1.78)
  other vias: 78.73,69.05
N$241  (via drill 1 pad 1.78)
  other vias: 78.73,66.51
N$242  (via drill 1 pad 1.78)
  other vias: 81.28,66.51
N$243  (via drill 1 pad 1.78)
  other vias: 81.28,69.05
N$244  (via drill 1 pad 1.78)
  other vias: 81.28,71.59
N$248
  Bottom 0.406: 31.75,56.98 TR.2 28.57,56.98 26.67,55.08 C23.1 | 31.75,56.98 33.02,58.26 R12.1 | 31.75,56.98 36.19,52.54 R11.1 FERITE.2
N$250
  Bottom 0.813: LED1.A 5.08,27.78 10.15,22.7 10.15,17.62 C11.+ 12.69,17.62 13.33,16.98 C16.1 15.23,16.35 D3.C
  Bottom 1.27: 22.86,8.09 21.59,9.36 21.59,10.63 D4.C 18.41,12.54 D3.C | 22.86,8.09 IC2.IN | D1.C 22.22,7.46 22.86,8.09
PA0
  Bottom 0.305: SV2.1 74.29,53.81 IC1.40
PA1
  Bottom 0.305: SV2.2 78.1,50 74.29,50 73.02,51.27 IC1.39
PA2
  Bottom 0.305: IC1.38 SV2.3
PA3
  Bottom 0.305: SV2.4 78.1,47.46 74.29,47.46 73.02,46.19 IC1.37
PA4
  Bottom 0.305: SV2.5 75.56,46.19 73.02,43.65 IC1.36
PA5
  Bottom 0.305: SV2.6 78.1,44.92 76.2,44.92 72.39,41.11 IC1.35
PA6
  Bottom 0.305: SV2.7 76.2,43.65 74.29,41.74 74.29,39.84 73.02,38.57 IC1.34
PA7
  Bottom 0.305: SV2.8 78.73,43.65 77.47,42.38 76.2,42.38 75.56,41.74 75.56,39.2 72.39,36.03 IC1.33
PC2
  Bottom 0.305: SV1.5 78.1,14.44 74.93,14.44 73.66,13.17 IC1.24
PC3
  Bottom 0.305: SV1.7 78.1,16.98 74.93,16.98 73.66,15.71 IC1.25
PC4
  Bottom 0.305: SV1.9 78.1,19.52 74.93,19.52 73.66,18.25 IC1.26
PC5
  Bottom 0.305: SV1.11 78.1,22.06 74.93,22.06 73.66,20.79 IC1.27
PC6
  Bottom 0.305: 78.73,23.33 77.47,24.6 74.93,24.6 73.66,23.33 IC1.28
  Bottom 0.406: 78.73,23.33 SV1.13
PC7
  Bottom 0.305: SV1.15 78.1,27.14 74.93,27.14 73.66,25.87 IC1.29
PD2
  Bottom 0.305: SV1.12 74.93,20.79 73.66,19.52 66.67,19.52 62.86,15.71 IC1.16
PD3
  Bottom 0.305: SV1.10 74.93,18.25 73.66,16.98 66.67,16.98 62.86,13.17 IC1.17
PD4
  Bottom 0.305: SV1.8 74.93,15.71 73.66,14.44 66.67,14.44 62.86,10.63 IC1.18
PD5
  Bottom 0.305: SV1.6 74.93,13.17 73.66,11.9 66.67,11.9 62.86,8.09 IC1.19
PD6
  Bottom 0.305: SV1.4 74.93,10.63 73.66,9.36 66.67,9.36 62.86,5.55 IC1.20
PD7
  Bottom 0.305: SV1.2 75.56,8.09 73.02,5.55 IC1.21
RXD  (via drill 0.6 pad 1.42)
  Top 0.305: v65.4,23.96 v65.4,60.16
  Bottom 0.254: v65.4,60.16 62.86,60.16 60.32,62.7 42.54,62.7 41.27,63.97 41.27,77.94 39.36,79.84 33.65,79.84 31.75,77.94 IC4.9
  Bottom 0.305: v65.4,23.96 61.59,23.96 58.41,20.79 IC1.14
SCK
  Bottom 0.254: IC5.8 31.75,31.59 34.28,34.12 40,34.12 41.27,32.86 43.81,32.86 45.71,34.76 52.06,34.76 53.34,36.03 IC1.8 58.41,36.03 60.32,37.94 60.32,41.11 59.05,42.38 53.97,42.38 52.7,43.65 52.7,53.81 50.16,56.35 PROG.7
SCL
  Bottom 0.305: SV1.1 78.1,9.36 74.93,9.36 73.66,8.09 IC1.22
SDA
  Bottom 0.305: SV1.3 78.1,11.9 74.93,11.9 73.66,10.63 IC1.23
TXD  (via drill 0.6 pad 1.42)
  Top 0.305: v63.49,20.79 v63.49,62.06
  Bottom 0.254: v63.49,62.06 61.59,63.97 43.81,63.97 42.54,65.24 42.54,77.94 39.36,81.11 33.02,81.11 32.38,80.48 IC4.10
  Bottom 0.305: v63.49,20.79 60.95,18.25 IC1.15
VCC  (via drill 0.6 pad 1.42)
  Top 0.305: v67.94,4.28 v67.94,22.06 | v67.94,29.05 v67.94,58.26
  Bottom 0.305: 57.14,30.95 IC1.10
  Bottom 0.406: SV1.14 74.93,23.33 73.66,22.06 69.84,22.06 69.21,22.7 | 69.21,22.7 69.21,27.14 | 69.21,27.14 69.21,27.78 v67.94,29.05 59.05,29.05 57.14,30.95 | SV2.10 77.47,38.57 77.47,33.49 78.73,32.22 | 69.21,22.7 68.58,22.06 v67.94,22.06 | v67.94,4.28 66.67,3.01 53.97,3.01 L1.1 | PROG.2 43.17,48.73 41.9,50 41.9,61.43 | C25.2 v67.94,58.26 62.22,58.26 59.05,61.43 41.9,61.43 | 78.73,32.22 C26.1 | 41.9,61.43 40,63.34 40,77.3 38.73,78.57 34.28,78.57 30.48,74.77 27.94,74.77 26.67,76.03 26.67,95.08 27.3,95.72 | 27.3,95.72 IC4.16 | 27.3,95.72 26.03,96.99 16.51,96.99 15.23,95.72 C8.2 | 78.73,32.22 73.66,27.14 69.21,27.14
  Bottom 0.61: IC4.16 31.75,95.72 33.02,94.45 C10.1 36.19,94.45 37.46,93.18 JP2.2 | JP2.2 JP2.3 | JP2.2 JP2.1
  Bottom 0.813: 38.09,8.09 49.52,8.09 50.79,6.82 R1.2 L1.1
  Bottom 1.27: IC2.OUT 31.75,8.09 32.38,7.46 | D1.A 32.38,7.46 | C13.+ 38.09,8.09 36.82,8.09 35.55,6.82 C15.1 35.55,7.46 33.65,9.36 33.65,8.73 | IC3.3 29.21,20.79 D2.C 31.75,16.35 33.65,14.44 33.65,8.73 | 32.38,7.46 33.65,8.73

### Text on the board
Bottom: U. Radig Ver.: 1.2